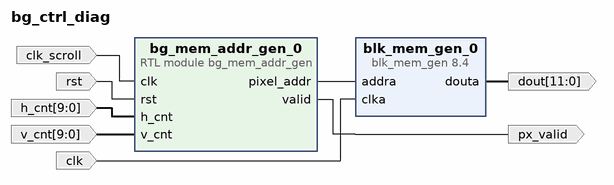
[diagram p0: block diagram of the top level]
# Vivado block design bg_ctrl_diag, xc7a35tcpg236-1, Vivado 2019.2
create_bd_design bg_ctrl_diag

create_bd_port -dir I clk
create_bd_port -dir I clk_scroll
create_bd_port -dir I rst
create_bd_port -dir O px_valid
create_bd_port -dir I -from 9 -to 0 h_cnt
create_bd_port -dir I -from 9 -to 0 v_cnt
create_bd_port -dir O -from 11 -to 0 dout

create_bd_cell -type module -reference bg_mem_addr_gen bg_mem_addr_gen_0
set_property -dict [list \
  CONFIG.BG_HEIGHT_CNT 240 \
  CONFIG.BG_WIDTH_CNT 320 \
  CONFIG.CNT_BITS_N 10 \
  CONFIG.PX_ADDR_BITS_N 17 \
] [get_bd_cells bg_mem_addr_gen_0]
create_bd_cell -type ip -vlnv xilinx.com:ip:blk_mem_gen:8.4 blk_mem_gen_0
set_property -dict [list \
  CONFIG.Coe_File ../../../../../../bg_big.coe \
  CONFIG.Enable_32bit_Address false \
  CONFIG.Enable_A Always_Enabled \
  CONFIG.Load_Init_File true \
  CONFIG.Read_Width_A 12 \
  CONFIG.Register_PortA_Output_of_Memory_Primitives true \
  CONFIG.Use_Byte_Write_Enable false \
  CONFIG.Use_RSTA_Pin false \
  CONFIG.Write_Depth_A 76800 \
  CONFIG.Write_Width_A 12 \
  CONFIG.use_bram_block Stand_Alone \
] [get_bd_cells blk_mem_gen_0]

# ---- connections ----

connect_bd_net [get_bd_ports clk_scroll] [get_bd_pins bg_mem_addr_gen_0/clk]
connect_bd_net [get_bd_ports clk] [get_bd_pins blk_mem_gen_0/clka]
connect_bd_net [get_bd_ports rst] [get_bd_pins bg_mem_addr_gen_0/rst]
connect_bd_net [get_bd_pins bg_mem_addr_gen_0/pixel_addr] [get_bd_pins blk_mem_gen_0/addra]
connect_bd_net [get_bd_pins bg_mem_addr_gen_0/valid] [get_bd_ports px_valid]
connect_bd_net [get_bd_ports h_cnt] [get_bd_pins bg_mem_addr_gen_0/h_cnt]
connect_bd_net [get_bd_ports v_cnt] [get_bd_pins bg_mem_addr_gen_0/v_cnt]
connect_bd_net [get_bd_pins blk_mem_gen_0/douta] [get_bd_ports dout]

validate_bd_design
save_bd_design
